# Altium schematic sheet Sheet1.SchDoc
size 839 x 594 mm; CheckedBy: Шемаров; Author: Зубков; CompanyName: ЭВС, гр. 850701; Organization: Altium Limited; Address1: L3, 12a Rodborough Rd; Address2: Frenchs Forest; Address3: NSW; Address4: Australia 2086; SheetTotal: 1; DecimalNumber: ГУИР.403137.001; Name1: Многофункциональные; lit_A: Т; Name2: электронные часы; Name3: на базе микроконтроллера; PageSetup: Record=PageOptions|CenterHorizontal=True|CenterVertical=True|PrintScale=0.35|XCorrection=1.00|YCorrection=1.00|PrintKind=1|BorderSize=5000000|LeftOffset=0|BottomOffset=0|Orientation=2|PaperLength=1000|PaperWidth=1000|Scale=100|PaperSource=7|PrintQuality=600|MediaType=1|DitherType=10|PaperKind=A4|PrintScaleMode=1
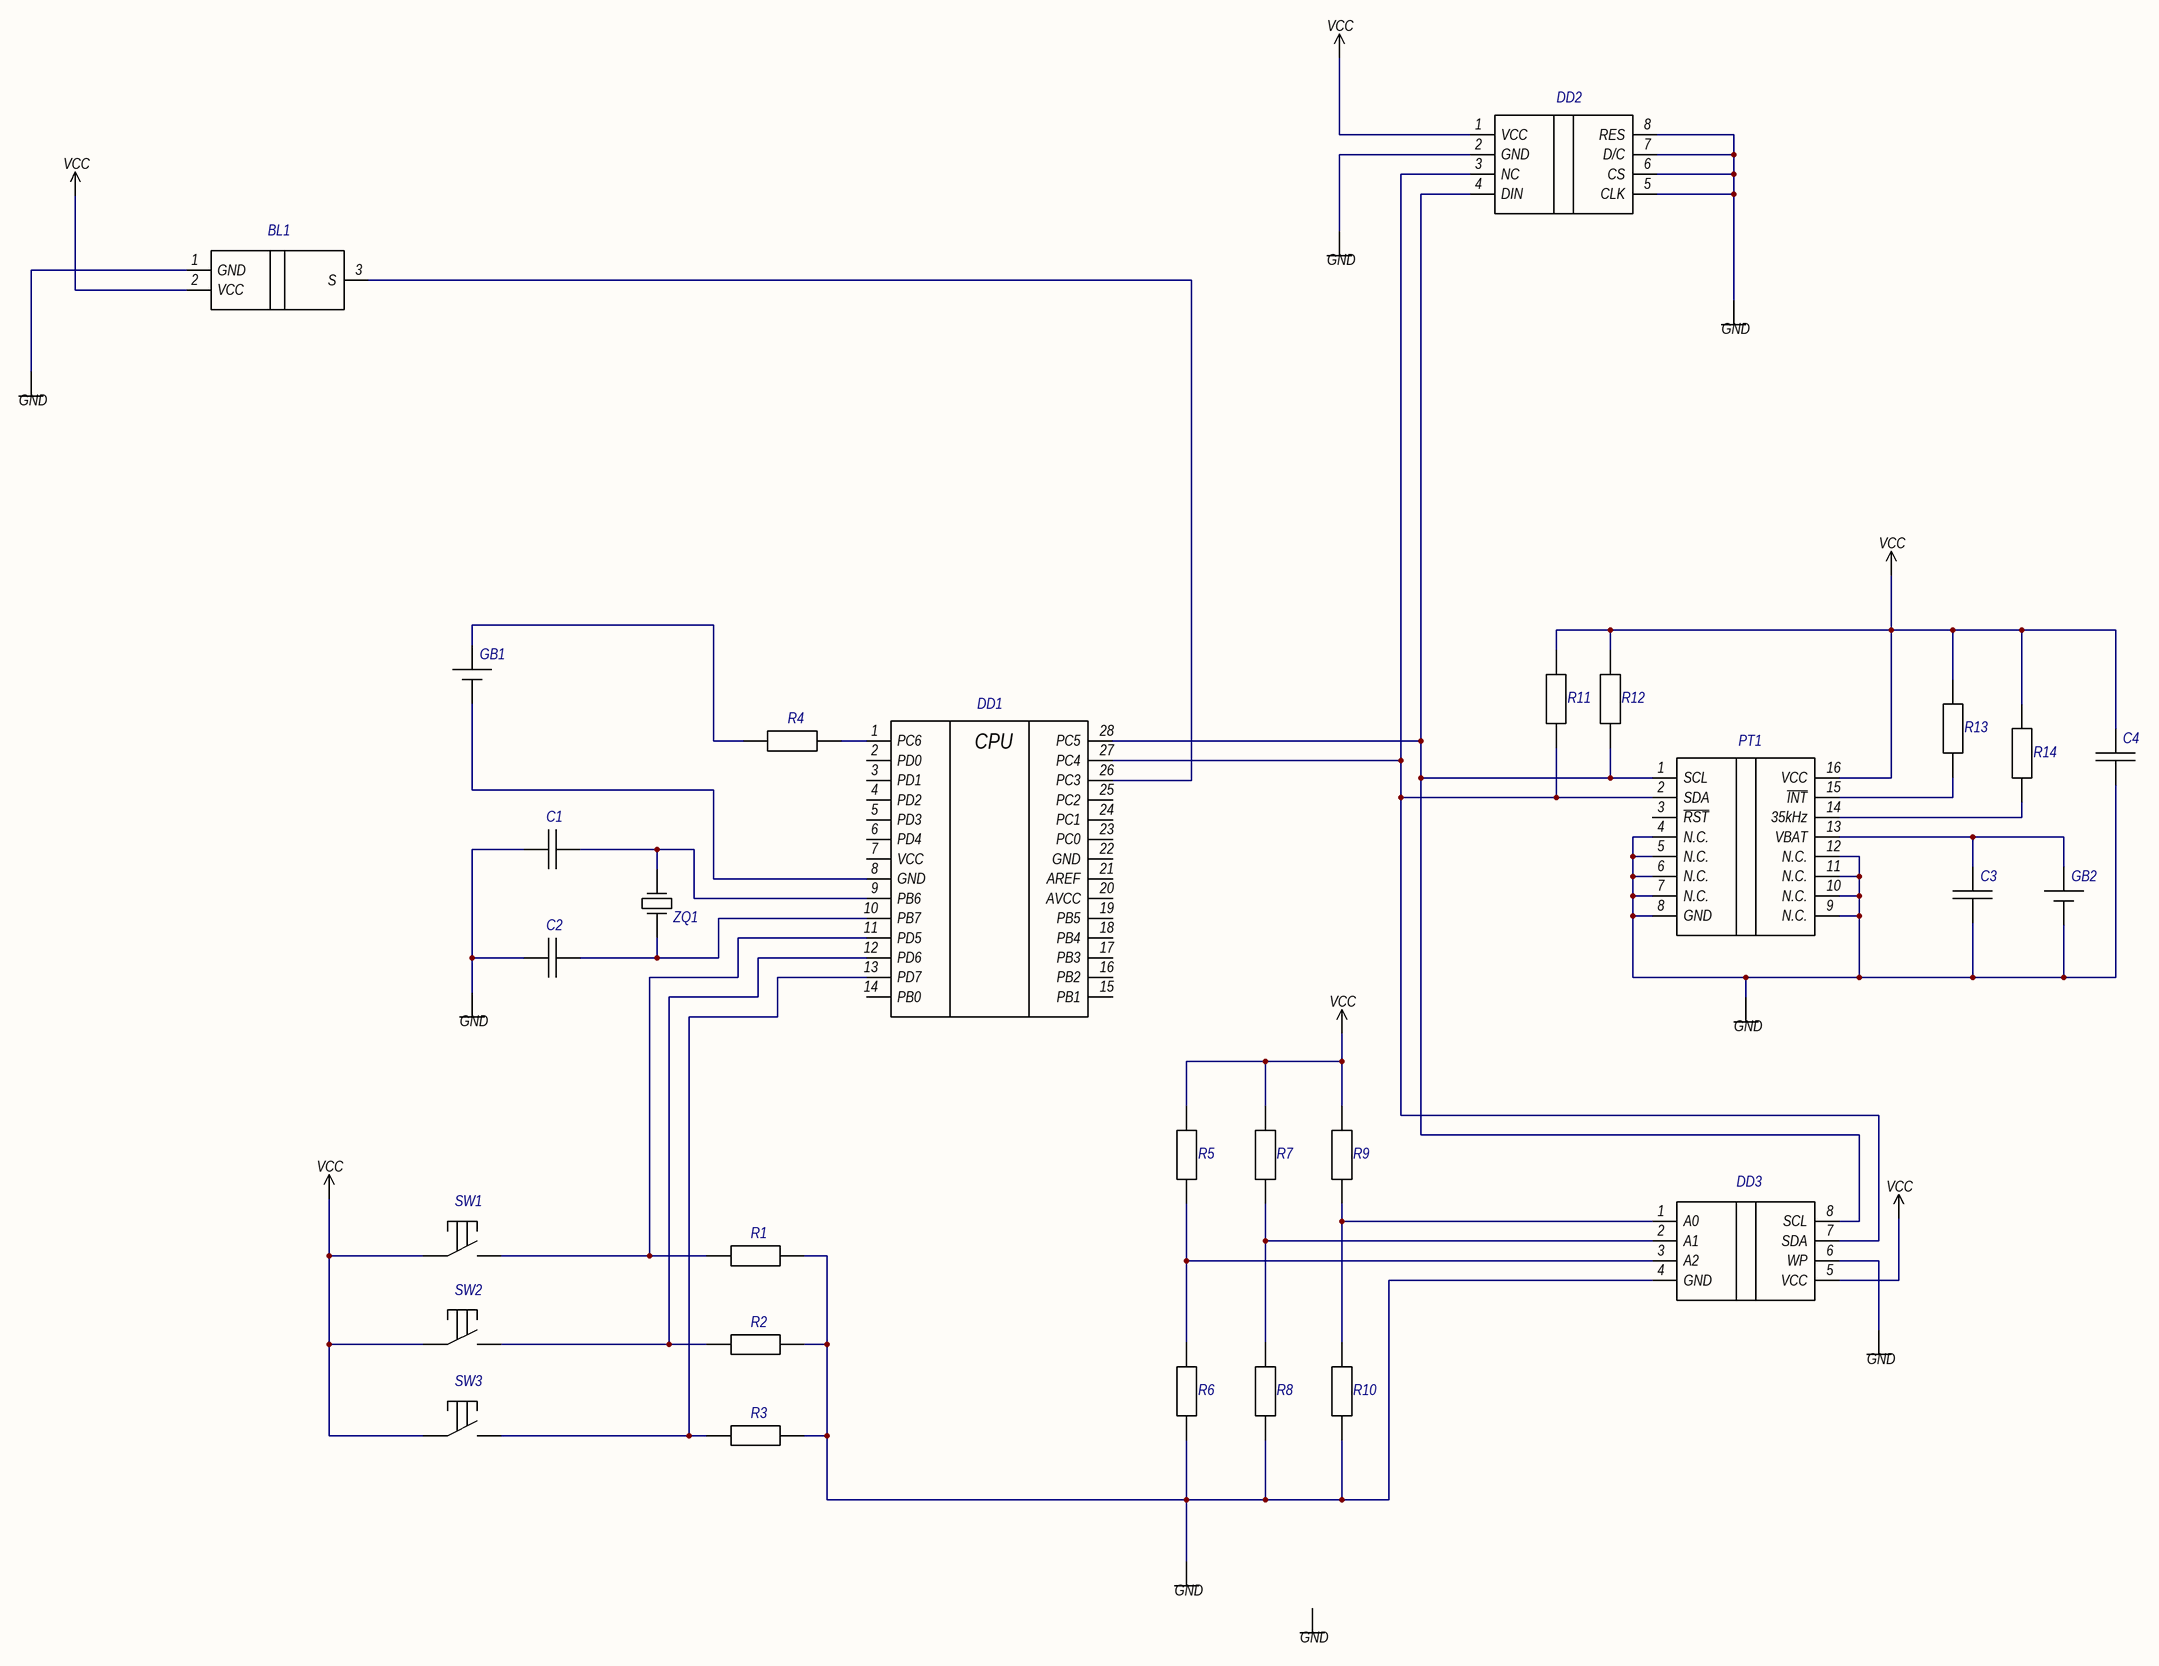
[diagram p0: Sheet1.SchDoc]

## Parts
(Parts that share a designator on the sheet are numbered #1, #2 ... from top to bottom, then left to right.)
*#1  VCC  (value not drawn)
*#2  VCC  (value not drawn)
*#3  GND  (value not drawn)
*#4  GND  (value not drawn)
*#5  GND  (value not drawn)
*#6  VCC  (value not drawn)
*#7  GND  (value not drawn)
*#8  GND  (value not drawn)
*#9  VCC  (value not drawn)
*#10  VCC  (value not drawn)
*#11  VCC  (value not drawn)
*#12  GND  (value not drawn)
*#13  GND  (value not drawn)
*#14  GND  (value not drawn)
BL1  Pulsesensor  (value not drawn)
C1  Capasitor  (value not drawn)
C2  Capasitor  (value not drawn)
C3  Capasitor  (value not drawn)
C4  Capasitor  (value not drawn)
DD1  ATmega328P  (value not drawn)
DD2  OLED  (value not drawn)
DD3  AT24C32N  (value not drawn)
GB1  Acc  (value not drawn)
GB2  Acc  (value not drawn)
PT1  DS3231  (value not drawn)
R1  Resistor  (value not drawn)
R2  Resistor  (value not drawn)
R3  Resistor  (value not drawn)
R4  Resistor  (value not drawn)
R5  Resistor  (value not drawn)
R6  Resistor  (value not drawn)
R7  Resistor  (value not drawn)
R8  Resistor  (value not drawn)
R9  Resistor  (value not drawn)
R10  Resistor  (value not drawn)
R11  Resistor  (value not drawn)
R12  Resistor  (value not drawn)
R13  Resistor  (value not drawn)
R14  Resistor  (value not drawn)
SW1  Button  (value not drawn)
SW2  Button  (value not drawn)
SW3  Button  (value not drawn)
ZQ1  Resonator  (value not drawn)

## Nets
Net*#1_1: *#1.1 DD2.1(VCC)
Net*#2_1: *#2.1 BL1.2(VCC)
Net*#3_1: *#3.1 DD2.2(GND)
Net*#4_1: *#4.1 DD2.5(CLK) DD2.6(CS) DD2.7(D/C) DD2.8(RES)
Net*#5_1: *#5.1 BL1.1(GND)
Net*#6_1: *#6.1 C4.2 PT1.16(VCC) R11.2 R12.2 R13.2 R14.2
Net*#7_1: *#7.1 C1.1 C2.1
Net*#8_1: *#8.1 C3.1 C4.1 GB2.1 PT1.4(N.C.) PT1.5(N.C.) PT1.6(N.C.) PT1.7(N.C.) PT1.8(GND) PT1.9(N.C.) PT1.10(N.C.) PT1.11(N.C.) PT1.12(N.C.)
Net*#9_1: *#9.1 R5.2 R7.2 R9.2
Net*#10_1: *#10.1 SW1.1 SW2.1 SW3.1
Net*#11_1: *#11.1 DD3.5(VCC)
Net*#12_1: *#12.1 DD3.6(WP)
Net*#13_1: *#13.1 DD3.4(GND) R1.2 R2.2 R3.2 R6.1 R8.1 R10.1
NetBL1_3: BL1.3(S) DD1.26(PC3)
NetC1_2: C1.2 DD1.9(PB6) ZQ1.2
NetC2_2: C2.2 DD1.10(PB7) ZQ1.1
NetC3_2: C3.2 GB2.2 PT1.13(VBAT)
NetDD1_1: DD1.1(PC6) R4.2
NetDD1_8: DD1.8(GND) GB1.1
NetDD1_11: DD1.11(PD5) R1.1 SW1.2
NetDD1_12: DD1.12(PD6) R2.1 SW2.2
NetDD1_13: DD1.13(PD7) R3.1 SW3.2
NetDD1_27: DD1.27(PC4) DD2.3(NC) DD3.7(SDA) PT1.2(SDA) R11.1
NetDD1_28: DD1.28(PC5) DD2.4(DIN) DD3.8(SCL) PT1.1(SCL) R12.1
NetDD3_1: DD3.1(A0) R9.1 R10.2
NetDD3_2: DD3.2(A1) R7.1 R8.2
NetDD3_3: DD3.3(A2) R5.1 R6.2
NetGB1_2: GB1.2 R4.1
NetPT1_14: PT1.14(35kHz) R14.1
NetPT1_15: PT1.15(~{INT}) R13.1

Not connected (* = marked no-connect by the designer): *#14 1; DD1 2(PD0) 3(PD1) 4(PD2) 5(PD3) 6(PD4) 7(VCC) 14(PB0) 15(PB1) 16(PB2) 17(PB3) 18(PB4) 19(PB5) 20(AVCC) 21(AREF) 22(GND) 23(PC0) 24(PC1) 25(PC2); PT1 3(~{RST})

## Notes on the sheet
- Перв.примен.
- Справ.№
- Подп. и дата
- Инв.№ дубл.
- Взам.инв.№
- Подп.и дата
- Разраб.
- Изм.
- Лист
- № докум.
- Подп.
- Дата
- Лит.
- Масштаб
- Масса
- Т.контр.
- Пров.
- Схема электрическая принципиальная
- Листов
- Инв.№ подл.
- Утв.
- Н.контр.
- Реценз.
- Формат  A1
- (in symbol ATmega328P) CPU